# EAGLE design micro-xum1541 (EAGLE 9.1.1)
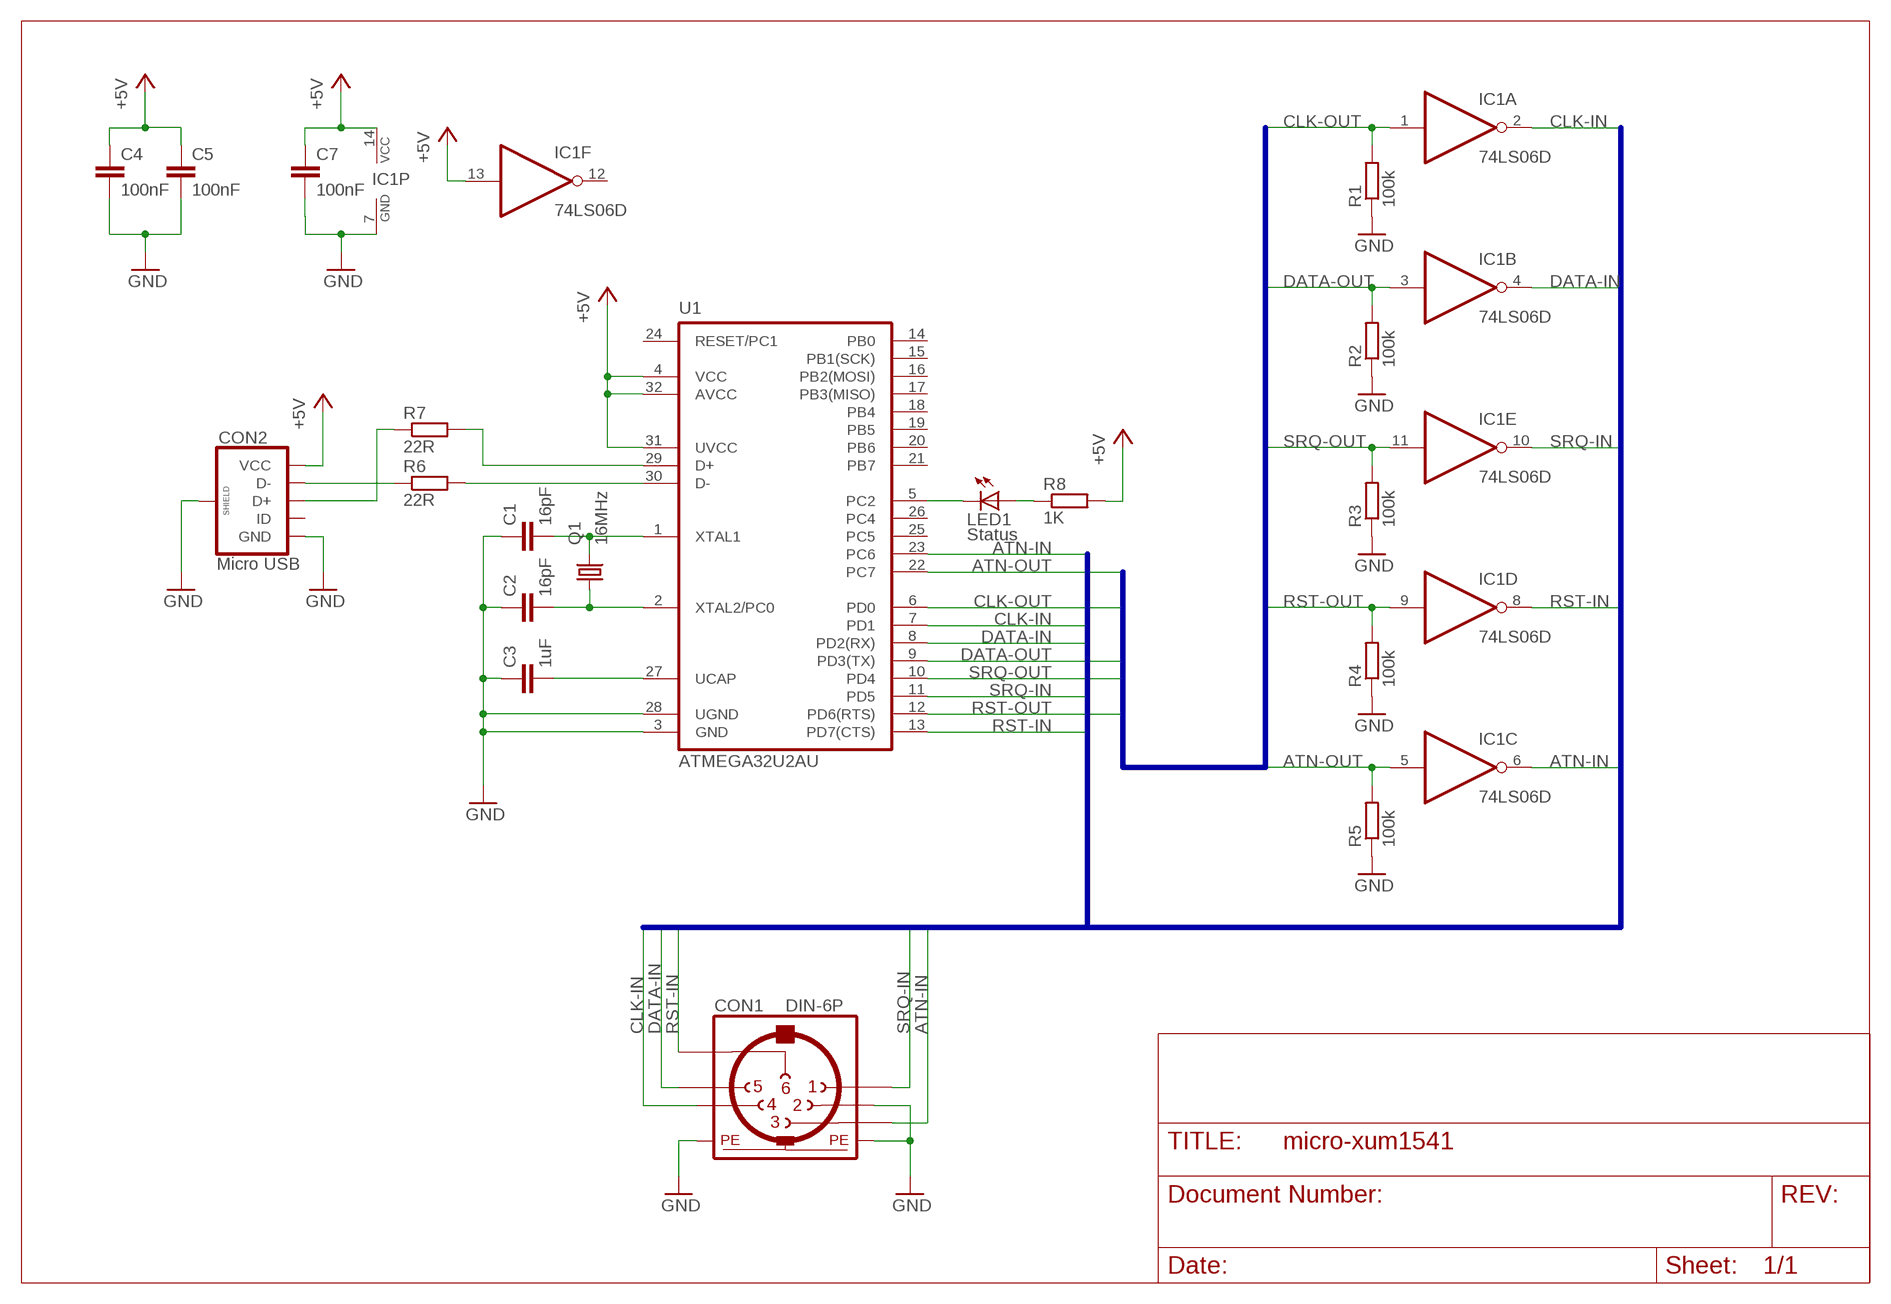
[diagram p0: schematic, sheet 1]

## Parts
C1  16pF  C-EUC0603K  [C0603K]
C2  16pF  C-EUC0603K  [C0603K]
C3  1uF  C-EUC0603  [C0603]
C4  100nF  C-EUC0603  [C0603]
C5  100nF  C-EUC0603  [C0603]
C7  100nF  C-EUC0603K  [C0603K]
CON1  DIN-6P  [6P]
CON2  Micro USB  MICRO-USB  [MICRO-USB]
IC1  74LS06D  [SO14]
LED1  Status  LEDCHIP-LED0805  [CHIP-LED0805]
Q1  16MHz  KX-6  [2.5X2.0_KX-6]
R1  100k  R-EU_R0603  [R0603]
R2  100k  R-EU_R0603  [R0603]
R3  100k  R-EU_R0603  [R0603]
R4  100k  R-EU_R0603  [R0603]
R5  100k  R-EU_R0603  [R0603]
R6  22R  R-EU_R0603  [R0603]
R7  22R  R-EU_R0603  [R0603]
R8  1K  R-EU_R0603  [R0603]
U1  ATMEGA32U2AU  ATMEGA32U2-AUTQFP  [TQFP32]

## Nets
+5V: C4.1 C5.1 C7.1 CON2.VBUS(VCC) IC1.13(F:I) IC1.14(P:VCC) R8.2 U1.4(VCC) U1.31(UVCC) U1.32(AVCC)
ATN-IN: CON1.3 IC1.6(C:O) U1.23(PC6)
ATN-OUT: IC1.5(C:I) R5.2 U1.22(PC7)
CLK-IN: CON1.4 IC1.2(A:O) U1.7(PD1)
CLK-OUT: IC1.1(A:I) R1.2 U1.6(PD0)
DATA-IN: CON1.5 IC1.4(B:O) U1.8(PD2(RX))
DATA-OUT: IC1.3(B:I) R2.2 U1.9(PD3(TX))
GND: C1.1 C2.1 C3.1 C4.2 C5.2 C7.2 CON1.2 CON1.PE1 CON1.PE2 CON2.GND CON2.SH1(SHIELD) CON2.SH2(SHIELD) CON2.SH3(SHIELD) CON2.SH4(SHIELD) IC1.7(P:GND) R1.1 R2.1 R3.1 R4.1 R5.1 U1.3(GND) U1.28(UGND)
N$3: C3.2 U1.27(UCAP)
N$7: CON2.D-1(D-) R6.1
N$8: R6.2 U1.30(D-)
N$9: R7.2 U1.29(D+)
N$10: CON2.D+1(D+) R7.1
N$12: LED1.A R8.1
N$13: LED1.C U1.5(PC2)
RST-IN: CON1.6 IC1.8(D:O) U1.13(PD7(CTS))
RST-OUT: IC1.9(D:I) R4.2 U1.12(PD6(RTS))
SRQ-IN: CON1.1 IC1.10(E:O) U1.11(PD5)
SRQ-OUT: IC1.11(E:I) R3.2 U1.10(PD4)
XTAL1: C1.2 Q1.3 U1.1(XTAL1)
XTAL2: C2.2 Q1.1 U1.2(XTAL2/PC0)
Unconnected: CON2.ID1(ID) IC1.12(F:O) U1.14(PB0) U1.15(PB1(SCK)) U1.16(PB2(MOSI)) U1.17(PB3(MISO)) U1.18(PB4) U1.19(PB5) U1.20(PB6) U1.21(PB7) U1.24(RESET/PC1) U1.25(PC5) U1.26(PC4)

## Buses
ATN-OUT,CLK-OUT,DATA-OUT,RST-OUT,SRQ-OUT
ATN-IN,CLK-IN,DATA-IN,RST-IN,SRQ-IN

## Library data of the parts
C1 C2 = rcl:C-EU: CAPACITOR, European symbol; OC_REICHELT: KEM C0G0603 16P; SPICEPREFIX: C
C3-C5 C7 = rcl:C-EU: CAPACITOR, European symbol; SPICEPREFIX: C
CON1 = DIN-Sockets:DIN-6P; CN_REICHELT: LUM 010599 06; SPICEPREFIX: X; VENDOR: Lumberg
CON2 = USB:MICRO-USB; CI_REICHELT: MIC USB BBU
IC1 = 74xx-eu:74*06: Hex INVERTER, open collector high-voltage output
LED1 = led:LED: LED OSRAM: - CHIPLED LG R971, LG N971, LY N971, LG Q971, LY Q971, LO R971, LY R971 LH N974, LH R974 LS Q976, LO Q976, LY Q976 LO Q996 - Hyper CHIPLED LW Q18S LB Q993, LB Q99A, LB R99A - SideLED LS A670, LO A670, LY A670, LG A670, LP A670 LB A673, LV A673, LT A673, LW A673 LH A674 LY A675 LS A676, LA A676, LO A676, LY A676, LW A676 LS A679, LY A679, LG A679 - Hyper Micro SIDELED® LS Y876, LA Y876, LO Y876, LY Y876 LT Y87S - SmartLED LW L88C, LW L88S LB L89C, LB L89S, LG L890 LS L89K, LO L89K, LY L89K LS L896, LA L896, LO L896, LY L896 - TOPLED LS T670, LO T670, LY T670, LG T670, LP T670 LSG T670, LSP T670, LSY T670, LOP T670, LYG T670 LG T671, LOG T671, LSG T671 LB T673, LV T673, LT T673, LW T673 LH T674 LS T676, LA T676, LO T676, LY T676, LB T676, LH T676, LSB T676, LW T676 LB T67C, LV T67C, LT T67C, LS T67K, LO T67K, LY T67K, LW E67C LS E67B, LA E67B, LO E67B, LY E67B, LB E67C, LV E67C, LT E67C LW T67C LS T679, LY T679, LG T679 LS T770, LO T770, LY T770, LG T770, LP T770 LB T773, LV T773, LT T773, LW T773 LH T774 LS E675, LA E675, LY E675, LS T675 LS T776, LA T776, LO T776, LY T776, LB T776 LHGB T686 LT T68C, LB T68C - Hyper Mini TOPLED® LB M676 - Mini TOPLED Santana® LG M470 LS M47K, LO M47K, LY M47K Source: http://www.osram.convergy.de LUXEON: - LUMILED® LXK2-PW12-R00, LXK2-PW12-S00, LXK2-PW14-U00, LXK2-PW14-V00 LXK2-PM12-R00, LXK2-PM12-S00, LXK2-PM14-U00 LXK2-PE12-Q00, LXK2-PE12-R00, LXK2-PE12-S00, LXK2-PE14-T00, LXK2-PE14-U00 LXK2-PB12-K00, LXK2-PB12-L00, LXK2-PB12-M00, LXK2-PB14-N00, LXK2-PB14-P00, LXK2-PB14-Q00 LXK2-PR12-L00, LXK2-PR12-M00, LXK2-PR14-Q00, LXK2-PR14-R00 LXK2-PD12-Q00, LXK2-PD12-R00, LXK2-PD12-S00 LXK2-PH12-R00, LXK2-PH12-S00 LXK2-PL12-P00, LXK2-PL12-Q00, LXK2-PL12-R00 Source: www.luxeon.com KINGBRIGHT: KA-3528ASYC Source: www.kingbright.com
Q1 = crystal-geyer_V1_0:KX: Quartz Crystals (MHz) SMD: KX - Serie Model Size l/w/h [mm] Frequency Range Frequency Stability Temp. Range [°C] Load Capacitance AECQ 200 availabel Datasheet KX-4 KX-5 KX-6 KX-7 KX-9A KX-9B KX-12A KX-12B KX-13 KX-20 KX-K KX-KS 1.6/1.2/0.3 2.0/1.6/0.45 2.5/2.0/0.55 3.2/2.5/0.8 5.0/3.2/1.0 5.0/3.2/1.1 6.0/3.5/1.1 6.0/3.5/1.0 7.0/5.0 /1.3 11.6/5.5/1.6 12.3/4.5/4.2 12.3/4.5/3.2 24.0 ~ 80.0 MHz 16.0 ~ 80.0 MHz 12.0 ~ 80.0 MHz 8.0 ~ 60.0 MHz 7,68 ~ 300,0 MHz 8,0 ~ 50,0 MHz 8,0 ~ 150,0 MHz 8,0 ~ 50,0 MHz 6,0 ~ 160,0 MHz 3,579 ~ 25,0 MHz 3,579 ~ 70,0 MHz 3,579 ~ 70,0 MHz ±10 … ±50ppm ±10 … ±50ppm ±10 … ±50ppm ±10 … ±50ppm ±10 … ±50ppm ±10 … ±50ppm ±10 … ±50ppm ±10 … ±50ppm ±10 … ±50ppm ±50ppm ±10 … ±50ppm ±10 … ±50ppm (*) -40°C …+85°C (*) -40°C …+125°C (*) -40°C …+125°C (*) -40°C …+125°C (*) -40°C …+105°C (*) -40°C …+105°C (*) -40°C …+125°C (*) -40°C …+105°C (*) -40°C …+105°C (*) -40°C …+105°C (*) -40°C …+85°C (*) -40°C …+85°C 8, 8…16 8, 8…16 10, 8…16 12, 7…20 16, 10…20 16, 10…20 16, 10…20 16, 12…20 16, 12…20 16, 12…20 16, 12…30 16, 12…30 - yes yes yes - - - - - - - - KX-4.pdf <http://www.geyer-electronic.de/uploads/tx_userartikelfrequenz/GEYER-KX-4.pdf> KX-5.pdf <http://www.geyer-electronic.de/uploads/tx_userartikelfrequenz/GEYER-KX-5.pdf> KX-6.pdf <http://www.geyer-electronic.de/uploads/tx_userartikelfrequenz/GEYER-KX-6.pdf> KX-7.pdf <http://www.geyer-electronic.de/uploads/tx_userartikelfrequenz/GEYER-KX-7.pdf> KX-9A.pdf <http://www.geyer-electronic.de/uploads/tx_userartikelfrequenz/GEYER-KX-9A.pdf> KX-9B.pdf <http://www.geyer-electronic.de/uploads/tx_userartikelfrequenz/GEYER-KX-9B.pdf> KX-12A.pdf <http://www.geyer-electronic.de/uploads/tx_userartikelfrequenz/GEYER-KX-12A.pdf> KX-12B.pdf <http://www.geyer-electronic.de/uploads/tx_userartikelfrequenz/GEYER-KX-12B.pdf> KX-13.pdf <http://www.geyer-electronic.de/uploads/tx_userartikelfrequenz/GEYER-KX-13.pdf> KX-20.pdf <http://www.geyer-electronic.de/uploads/tx_userartikelfrequenz/GEYER-KX-20.pdf> KX-K.pdf <http://www.geyer-electronic.de/uploads/tx_userartikelfrequenz/GEYER-KX-K.pdf> KX-KS.pdf <http://www.geyer-electronic.de/uploads/tx_userartikelfrequenz/GEYER-KX-KS.pdf> <http://www.geyer-electronic.de/fileadmin/template/img/logo-geyer-electronic.png> Details see: http://www.geyer-electronic.de/Frequenz-Produkte.9.0.html Created 2016-06-07, Hans Locher 2016 (C) Geyer Quartz Technology KX4,KX5,KX6,KX7,KX9A,KX9B,KX12A,KX12B,KX13,KX20,KXK,KXKS;1612;2016;2520;3225;5032;6035;7050;11655;12345;1,6x1,2;2,0x1,6;2,5x2,0;3,2x2,5;5,0x3,2;6,0x3,5;7,0x5,0;11,6x5,5;12,3x4,5;12,3x4,5;1.6x1.2;2.0x1.6;2.5x2.0;3.2x2.5;5.0x3.2;6.0x3.5;7.0x5.0;11.6x5.5;12.3x4.5;12.3x4.5;
R1-R8 = rcl:R-EU_: RESISTOR, European symbol; SPICEPREFIX: R
U1 = Atmel-ATMEGA32U2-AU:ATMEGA32U2-AU; DESCRIPTION: 8-bit Microcontroller with ISP Flash and USB Controller; MPN: ATMEGA32U2-AU; OC_FARNELL: 1748524; OC_NEWARK: 26R5632; OC_REICHELT: ATMEGA 32-U2 TQ; PACKAGE: TQFP-32; SUPPLIER: Atmel

## Board
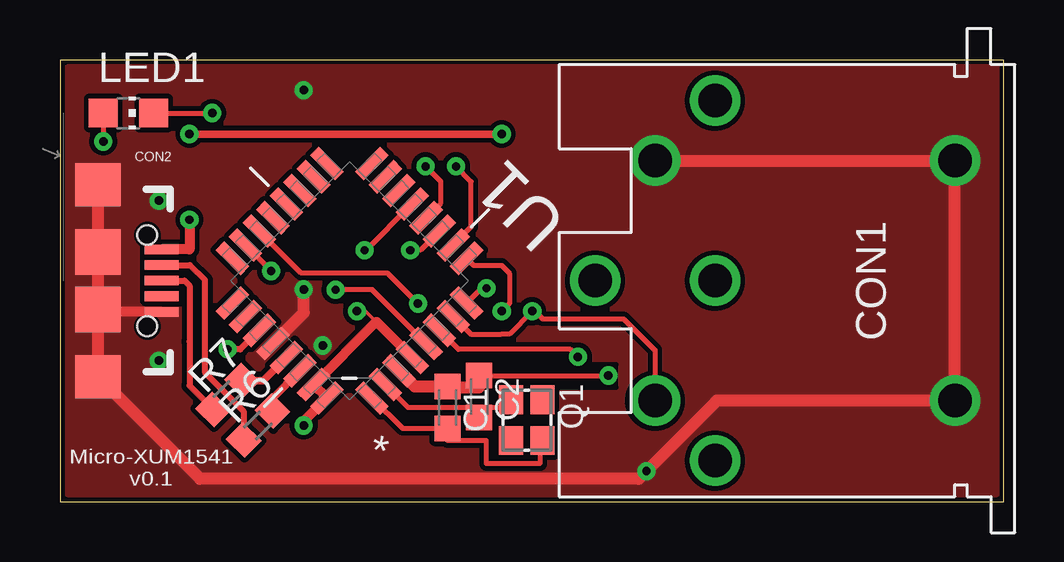
[diagram p1: board, top side]
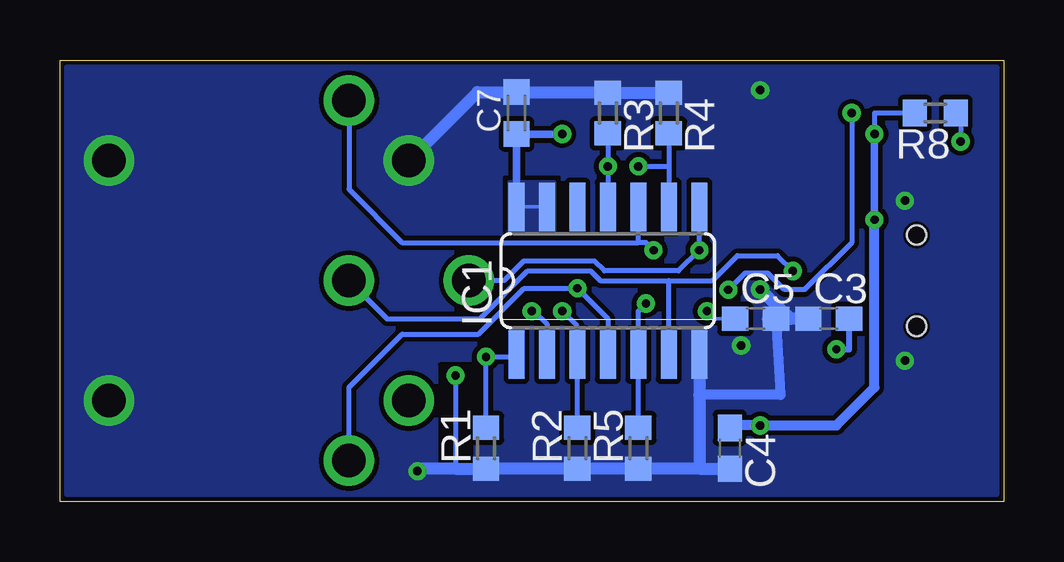
[diagram p2: board, bottom side, seen from below]

Size 39.35 x 18.4 mm. Coordinates in mm from the lower left corner, seen from the top.
Outline: 0,0 39.35,0 39.35,18.4 0,18.4 0,0
Copper layers (1*16): Top 0.035mm / dielectric 1.5mm / Bottom 0.035mm
Design rules "default *": minimum track width 6mil, minimum drill 0.35mm, track to track 8mil, track to pad 8mil, pad to pad 8mil, via to via 8mil, smd to smd 8mil, copper to edge 6mil, drill to drill 6mil, minimum pad ring 10mil, minimum via ring 8mil, stop-mask expansion 2mil, vias tented up to drill 40mil, thermal gap 10mil
tRestrict: area 13.3,4.1 to 23.2,6.3
bRestrict: area 22.2,1.3 to 23.5,5.7

### Footprints (pad centres in the part's own frame; a part is rotated, then mirrored left to right if it is on the bottom)
C0603K = smd 1.05 x 1.08: 1 -0.875,0; 2 0.875,0
C0603 = smd 1.1 x 1: 1 -0.85,0; 2 0.85,0
6P = drill 1.4: 1 0,-7.5; 2 2.5,-5; 3 0,0; 4 2.5,5; 5 0,7.5; 6 5,0; PE1 -10,5; PE2 -10,-5
MICRO-USB = smd 1.4 x 0.4: D+1 2.65,0; D-1 2.65,0.65; GND 2.65,-1.3; ID1 2.65,-0.65; VBUS 2.65,1.3 | smd 1.9 x 1.8: SH1 0,4; SH4 0,-4 | smd 1.9 x 1.9: SH2 0,1.2; SH3 0,-1.2 | hole 0.8: 2.05,1.9; 2.05,-1.9
SO14 = smd 0.66 x 2.032: 1 -3.81,-3.073; 2 -2.54,-3.073; 3 -1.27,-3.073; 4 0,-3.073; 5 1.27,-3.073; 6 2.54,-3.073; 7 3.81,-3.073; 8 3.81,3.073; 9 2.54,3.073; 10 1.27,3.073; 11 0,3.073; 12 -1.27,3.073; 13 -2.54,3.073; 14 -3.81,3.073
CHIP-LED0805 = smd 1.2 x 1.2: A 0,-1.05; C 0,1.05
2.5X2.0_KX-6 = smd 1.2 x 1: 1 -0.85,-0.65; 2 0.85,-0.65; 3 0.85,0.65; 4 -0.85,0.65
R0603 = smd 1 x 1.1: 1 -0.85,0; 2 0.85,0
TQFP32 = smd 1.473 x 0.508: 1 -4.115,2.794; 2 -4.115,2.007; 3 -4.115,1.194; 4 -4.115,0.406; 5 -4.115,-0.406; 6 -4.115,-1.194; 7 -4.115,-2.007; 8 -4.115,-2.794; 17 4.115,-2.794; 18 4.115,-2.007; 19 4.115,-1.194; 20 4.115,-0.406; 21 4.115,0.406; 22 4.115,1.194; 23 4.115,2.007; 24 4.115,2.794 | smd 0.508 x 1.473: 9 -2.794,-4.115; 10 -2.007,-4.115; 11 -1.194,-4.115; 12 -0.406,-4.115; 13 0.406,-4.115; 14 1.194,-4.115; 15 2.007,-4.115; 16 2.794,-4.115; 25 2.794,4.115; 26 2.007,4.115; 27 1.194,4.115; 28 0.406,4.115; 29 -0.406,4.115; 30 -1.194,4.115; 31 -2.007,4.115; 32 -2.794,4.115

### Placement (x,y rotation side)
C1  16.15,3.92 270 top
C2  17.48,4.38 270 top
C3  7.3,7.62 0 bottom
C4  11.43,2.22 270 bottom
C5  10.35,7.62 0 bottom
C7  20.32,16.19 90 bottom
CON1  27.3,9.21 180 top
CON2  1.59,9.21 0 top
IC1  16.51,9.21 0 bottom
LED1  2.86,16.19 270 top
Q1  19.46,3.4 270 top
R1  21.59,2.22 90 bottom
R2  17.78,2.22 90 bottom
R3  16.51,16.19 270 bottom
R4  13.97,16.19 270 bottom
R5  15.24,2.22 90 bottom
R6  8.26,3.17 45 top
R7  6.99,4.45 45 top
R8  2.86,16.19 180 bottom
U1  12.06,9.21 135 top

### Tracks (layer width: path | path; a pad name or v marks a point on that pad's centre or on a via)
+5V  (via drill 0.35)
  Top 0.152: v12.38,7.94 12.74,7.94 13.19,7.49
  Top 0.305: 13.19,7.49 13.21,7.49 | v18.41,15.32 v5.4,15.32 | U1.32
  Top 0.406: U1.4 13.21,7.49 | v10.16,3.17 10.16,3.35 U1.32 U1.31 13.19,7.49 | CON2.VBUS 5.4,10.51 v5.4,11.75
  Bottom 0.152: C5.1 12.06,7.62 v12.38,7.94 | IC1.13 IC1.14
  Bottom 0.203: R8.2 5.4,16.19 v5.4,15.32
  Bottom 0.305: IC1.14 C7.1 v18.41,15.32 | 11.33,3.17 C4.1 | v5.4,11.75 v5.4,15.32
  Bottom 0.406: 11.33,3.17 v10.16,3.17 6.99,3.17 5.4,4.76 v5.4,11.75
  pour Bottom (no thermals): 18.73,13.34 20.64,13.34 20.64,11.27 18.73,11.27
ATN-IN  (via drill 0.35)
  Top 0.203: U1.23 7.74,10.68 v8.8,9.61
  Bottom 0.203: CON1.3 25.72,7.62 21.85,7.62 19.85,9.61 17.23,9.61 16.83,9.21 13.97,9.21 | 13.97,9.21 12.15,9.21 11.11,10.25 9.44,10.25 v8.8,9.61 | IC1.6 13.97,9.21
ATN-OUT  (via drill 0.35)
  Top 0.203: v14.92,8.26 13.65,9.53 10.06,9.53 U1.22
  Bottom 0.203: R5.2 15.24,4.45 IC1.5 15.24,7.94 v14.92,8.26
CLK-IN  (via drill 0.35)
  Top 0.203: U1.7 17.12,6.99 18.41,6.99 18.73,6.99 v19.68,7.94 19.8,7.94 20.12,7.62 23.5,7.62 24.8,6.31 CON1.4
  Bottom 0.203: v19.68,7.94 19.58,7.94 19.05,7.4 IC1.2
CLK-OUT  (via drill 0.35)
  Top 0.203: v21.59,6.03 21.27,6.35 16.61,6.35 U1.6
  Bottom 0.203: R1.2 v21.59,6.03 20.42,6.03 IC1.1
DATA-IN  (via drill 0.35)
  Top 0.203: v17.78,8.89 17.57,8.89 U1.8
  Bottom 0.203: CON1.5 27.3,4.76 25.08,6.99 21.91,6.99 20,8.89 19.05,8.89 v17.78,8.89 16.51,7.62 16.51,7.09 IC1.4
DATA-OUT  (via drill 0.35)
  Top 0.203: v18.41,7.94 18.73,8.26 18.73,9.53 18.41,9.84 17.25,9.84 U1.9
  Bottom 0.203: v18.41,7.94 17.78,7.3 IC1.3 R2.2
GND  (via drill 0.35)
  Top 0.203: C1.1 16.19,4.76 | 17.46,4.76 17.46,5.24 C2.1 v22.86,5.26
  Top 0.406: CON2.GND 1.62,7.91 1.59,7.94
  Top 0.508: U1.3 14.79,4.8 C1.1 | 16.19,4.76 17.46,4.76 | CON1.2 CON1.PE2 CON1.PE1 27.39,4.21 v24.45,1.27 24.13,0.95 5.84,0.95 CON2.SH4 1.59,7.94 CON2.SH3 CON2.SH2 CON2.SH1 | U1.28 10.16,7.88 v10.16,8.84
  Bottom 0.203: v22.86,5.26 22.86,1.37
  Bottom 0.305: 16.54,17.07 R3.1
  Bottom 0.406: C5.2 9.31,4.45 12.7,4.45
  Bottom 0.508: 12.7,1.37 C4.2 | IC1.7 12.7,4.45 12.7,1.37 | 12.7,1.37 R5.1 R2.1 R1.1 22.86,1.37 24.34,1.37 v24.45,1.27 | CON1.2 21.95,17.07 C7.2 16.54,17.07 | R3.1 R4.1 | v10.16,8.84 8.89,7.62 | C5.2 9.84,7.62 8.89,7.62 | C3.1 8.89,7.62
  other vias: 10.95,6.51 4.13,5.87 10.16,17.14 4.13,12.54
  pour Top (no thermals): 0.32,17.78 0.32,0.32 39.05,0.32 39.05,18.1 0.32,18.1
  pour Bottom (rank 2, no thermals): 0.32,18.1 0.32,0.32 39.05,0.32 39.05,18.1
N$3  (via drill 0.35)
  Top 0.254: U1.27 7.52,6.35 v6.99,6.35
  Bottom 0.254: v6.99,6.35 6.45,6.35 C3.2
N$7
  Top 0.254: CON2.D-1 5.41,9.86 6.03,9.24 6.03,5.4 7.65,3.78 R6.1
N$8
  Top 0.305: U1.30 8.86,4.31 R6.2
N$9
  Top 0.305: U1.29 8.48,5.05 R7.2
N$10
  Top 0.254: R7.1 5.4,4.83 5.4,6.67 5.4,9 5.19,9.21 CON2.D+1
N$12  (via drill 0.35)
  Top 0.203: LED1.A v1.81,15.01
  Bottom 0.203: R8.1 LED1.A v1.81,15.01
N$13  (via drill 0.35)
  Top 0.203: U1.5 13.02,8.83 v11.49,8.83 | LED1.C v6.35,16.19
  Bottom 0.203: v11.49,8.83 10.79,9.53 9.84,9.53 9.15,8.83 8.31,8.83 6.35,10.79 v6.35,16.19
RST-IN  (via drill 0.35)
  Top 0.203: U1.13 12.7,10.42 v12.7,10.48
  Bottom 0.203: IC1.8 v12.7,10.48 13.56,9.61 16.66,9.61 17.07,10.02 20.02,10.02 20.83,9.21 CON1.6
RST-OUT  (via drill 0.35)
  Top 0.203: U1.12 15.88,12.44 15.88,13.34 v15.24,13.97
  Bottom 0.203: R4.2 13.97,13.97 | 13.97,13.97 IC1.9 | v15.24,13.97 13.97,13.97
SRQ-IN  (via drill 0.35)
  Top 0.203: U1.11 15.02,10.48 v14.61,10.48
  Bottom 0.203: CON1.1 27.3,13.02 25.08,10.79 15.24,10.79 | 15.24,10.79 IC1.10 | v14.61,10.48 14.92,10.79 15.24,10.79
SRQ-OUT  (via drill 0.35)
  Top 0.203: U1.10 17.14,11.45 17.14,13.34 v16.51,13.97
  Bottom 0.203: R3.2 v16.51,13.97 IC1.11
XTAL1
  Top 0.203: U1.1 14.27,3.05 C1.2 16.15,2.54 17.78,2.54 17.78,1.59 20,1.59 20,2.55 Q1.3
XTAL2
  Top 0.203: U1.2 14.5,3.93 17.46,3.93 | 17.46,3.93 18.73,3.93 18.73,4.25 Q1.1 | C2.2 17.46,3.52 17.46,3.93

### Text on the board
tSilk: Micro-XUM1541 / v0.1